# EAGLE design OnofreWireShield (EAGLE 9.3.2)
CNAME: BH ONOFRE; CREVISION: 5.1; DESIGNER: BrunoHorta
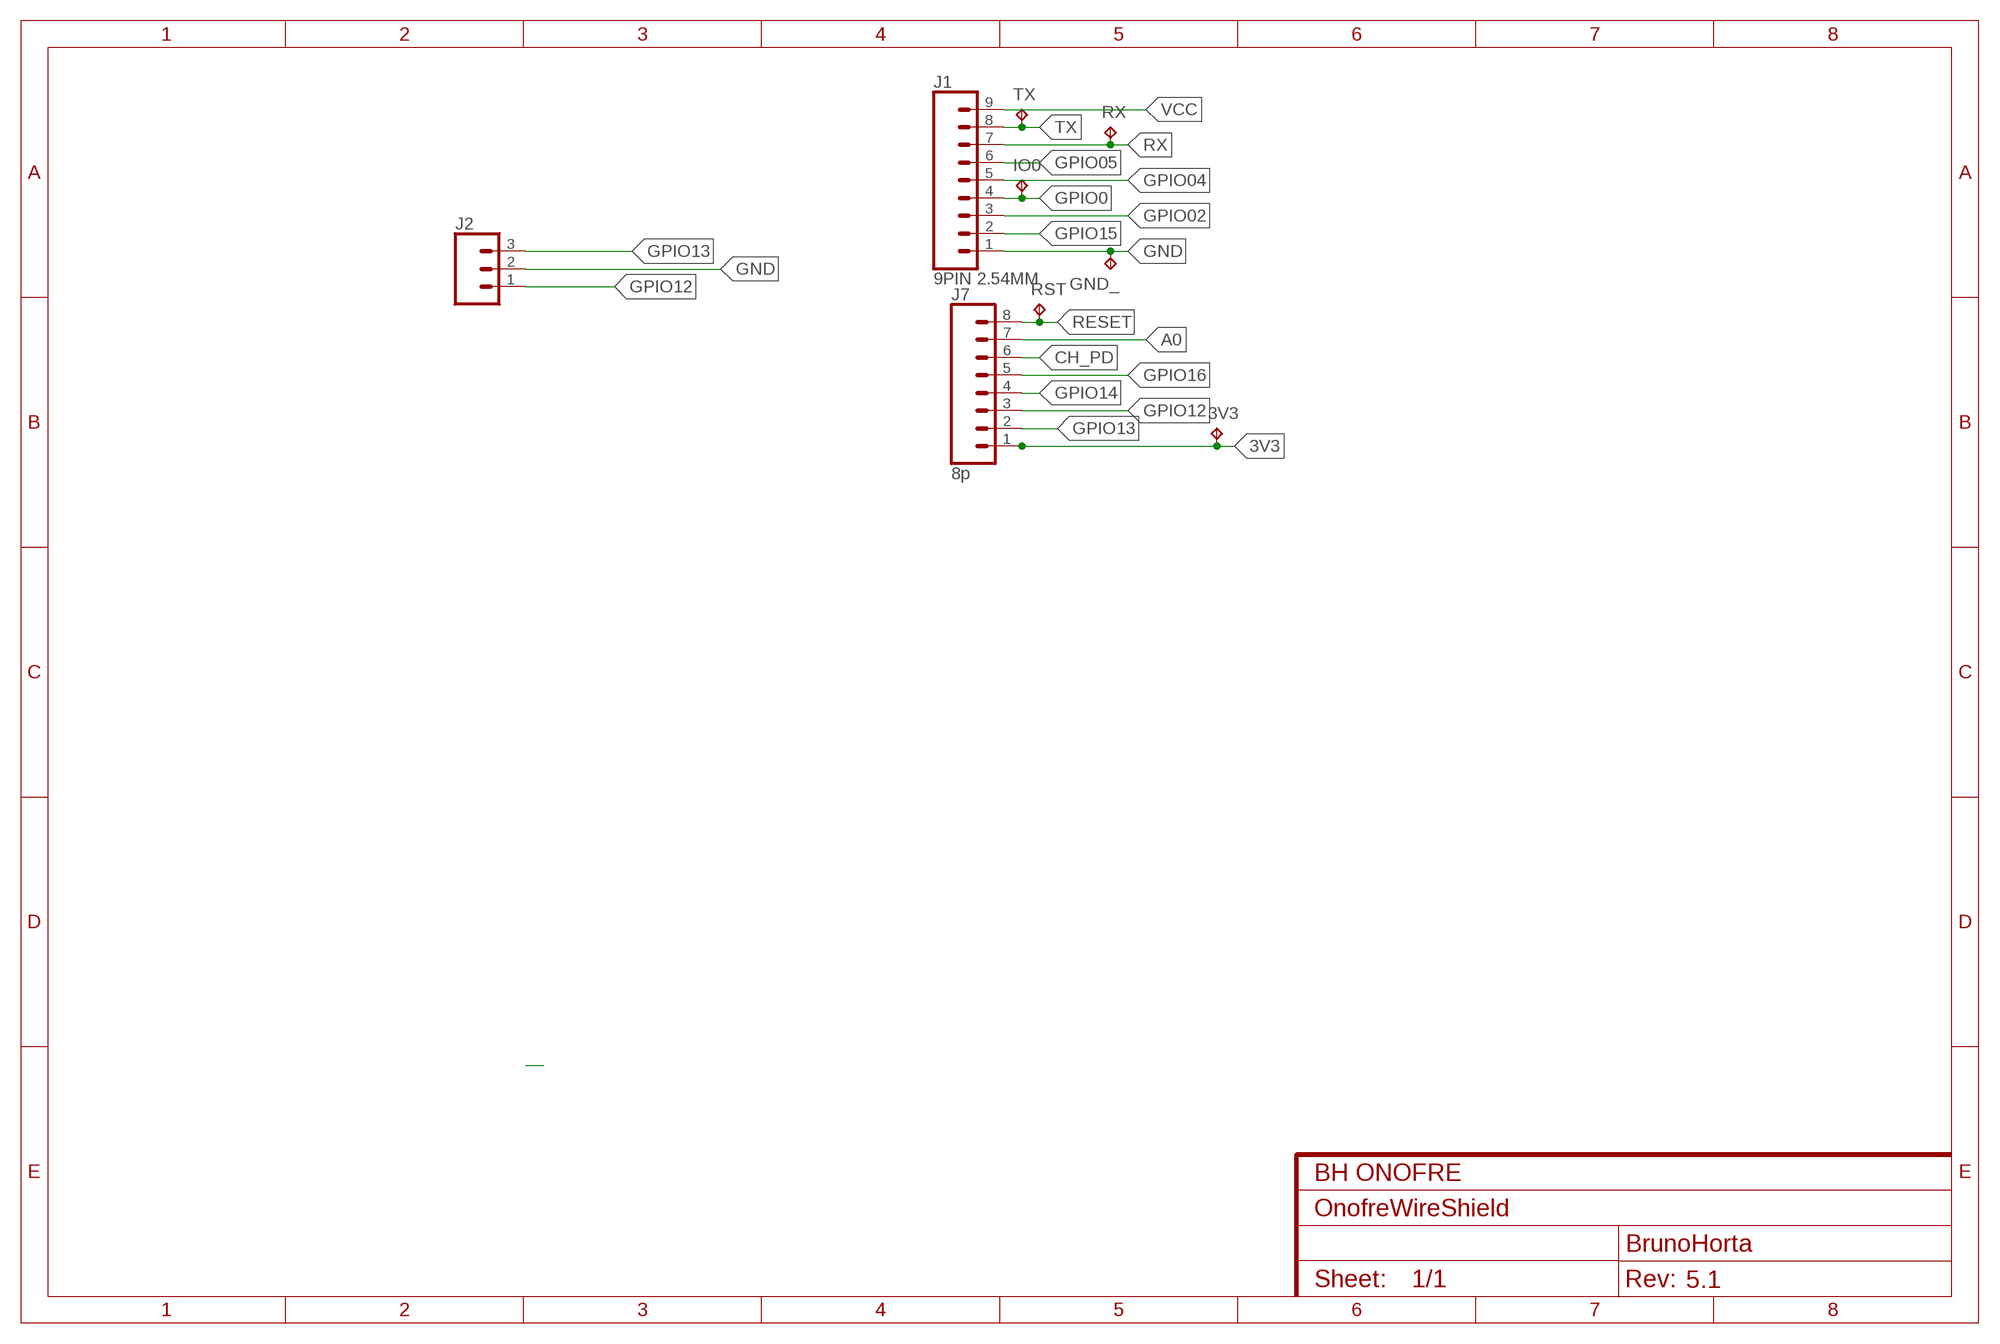
[diagram p0: schematic, sheet 1]

## Parts
3V3  TPB1,27  [B1,27]
GND_  TPB1,27  [B1,27]
IO0  TPB1,27  [B1,27]
J1  9PIN 2.54MM  CONN_09  [1X09]
J2  CONN_03  [1X03]
J7  8p  CONN_08"  [1X08]
RST  TPB1,27  [B1,27]
RX  TPB1,27  [B1,27]
TX  TPB1,27  [B1,27]

## Nets
3V3: 3V3.TP J7.1
A0: J7.7
CH_PD: J7.6
GND: GND_.TP J1.1 J2.2
GPIO0: IO0.TP J1.4
GPIO02: J1.3
GPIO04: J1.5
GPIO05: J1.6
GPIO12: J2.1 J7.3
GPIO13: J2.3 J7.2
GPIO14: J7.4
GPIO15: J1.2
GPIO16: J7.5
RESET: J7.8 RST.TP
RX: J1.7 RX.TP
TX: J1.8 TX.TP
VCC: J1.9

## Library data of the parts
3V3 GND_ IO0 RST RX TX = testpad:TP: Test pad
J1 = SparkFun-Connectors:CONN_09: Multi connection point. Often used as Generic Header-pin footprint for 0.1 inch spaced/style header connections On any of the 0.1 inch spaced packages, you can populate with these: Break Away Headers - Straight <https://www.sparkfun.com/products/116> (PRT-00116) Break Away Male Headers - Right Angle <https://www.sparkfun.com/products/553> (PRT-00553) Female Headers <https://www.sparkfun.com/products/115> (PRT-00115) Break Away Headers - Machine Pin <https://www.sparkfun.com/products/117> (PRT-00117) Break Away Female Headers - Swiss Machine Pin <https://www.sparkfun.com/products/743> (PRT-00743) For SCREWTERMINALS and SPRING TERMINALS visit here: Screw Terimnals on SparkFun.com <https://www.sparkfun.com/search/results?term=Screw+Terminals> (5mm/3.5mm/2.54mm spacing) This device is also useful as a general connection point to wire up your design to another part of your project. Our various solder wires solder well into these plated through hole pads. Hook-Up Wire - Assortment (Stranded, 22 AWG) <https://www.sparkfun.com/products/11375> (PRT-11375) Hook-Up Wire - Assortment (Solid Core, 22 AWG) <https://www.sparkfun.com/products/11367> (PRT-11367) View the entire wire category on our website here <https://www.sparkfun.com/categories/141> Special notes: Molex polarized connector foot print use with SKU : PRT-08231 with associated crimp pins and housings. 1MM SMD Version SKU: PRT-10208 NOTES ON THE VARIANTS LOCK and LOCK_LONGPADS... This footprint was designed to help hold the alignment of a through-hole component (i.e. 6-pin header) while soldering it into place. You may notice that each hole has been shifted either up or down by 0.005 of an inch from it's more standard position (which is a perfectly straight line). This slight alteration caused the pins (the squares in the middle) to touch the edges of the holes. Because they are alternating, it causes a "brace" to hold the component in place. 0.005 has proven to be the perfect amount of "off-center" position when using our standard breakaway headers. Although looks a little odd when you look at the bare footprint, once you have a header in there, the alteration is very hard to notice. Also,if you push a header all the way into place, it is covered up entirely on the bottom side.
J2 = SparkFun-Connectors:CONN_03: Multi connection point. Often used as Generic Header-pin footprint for 0.1 inch spaced/style header connections On any of the 0.1 inch spaced packages, you can populate with these: Break Away Headers - Straight <https://www.sparkfun.com/products/116> (PRT-00116) Break Away Male Headers - Right Angle <https://www.sparkfun.com/products/553> (PRT-00553) Female Headers <https://www.sparkfun.com/products/115> (PRT-00115) Break Away Headers - Machine Pin <https://www.sparkfun.com/products/117> (PRT-00117) Break Away Female Headers - Swiss Machine Pin <https://www.sparkfun.com/products/743> (PRT-00743) Stackable Header - 3 Pin (Female, 0.1") <https://www.sparkfun.com/products/13875> (PRT-13875) For SCREWTERMINALS and SPRING TERMINALS visit here: Screw Terimnals on SparkFun.com <https://www.sparkfun.com/search/results?term=Screw+Terminals> (5mm/3.5mm/2.54mm spacing) This device is also useful as a general connection point to wire up your design to another part of your project. Our various solder wires solder well into these plated through hole pads. Hook-Up Wire - Assortment (Stranded, 22 AWG) <https://www.sparkfun.com/products/11375> (PRT-11375) Hook-Up Wire - Assortment (Solid Core, 22 AWG) <https://www.sparkfun.com/products/11367> (PRT-11367) View the entire wire category on our website here <https://www.sparkfun.com/categories/141> Special notes: Molex polarized connector foot print use with SKU : PRT-08232 with associated crimp pins and housings.
J7 = SparkFun-Connectors:CONN_08: Multi connection point. Often used as Generic Header-pin footprint for 0.1 inch spaced/style header connections On any of the 0.1 inch spaced packages, you can populate with these: Break Away Headers - Straight <https://www.sparkfun.com/products/116> (PRT-00116) Break Away Male Headers - Right Angle <https://www.sparkfun.com/products/553> (PRT-00553) Female Headers <https://www.sparkfun.com/products/115> (PRT-00115) Break Away Headers - Machine Pin <https://www.sparkfun.com/products/117> (PRT-00117) Break Away Female Headers - Swiss Machine Pin <https://www.sparkfun.com/products/743> (PRT-00743) Arduino Stackable Header - 8 Pin <https://www.sparkfun.com/products/9279> (PRT-09279) For SCREWTERMINALS and SPRING TERMINALS visit here: Screw Terimnals on SparkFun.com <https://www.sparkfun.com/search/results?term=Screw+Terminals> (5mm/3.5mm/2.54mm spacing) This device is also useful as a general connection point to wire up your design to another part of your project. Our various solder wires solder well into these plated through hole pads. Hook-Up Wire - Assortment (Stranded, 22 AWG) <https://www.sparkfun.com/products/11375> (PRT-11375) Hook-Up Wire - Assortment (Solid Core, 22 AWG) <https://www.sparkfun.com/products/11367> (PRT-11367) View the entire wire category on our website here <https://www.sparkfun.com/categories/141> Special notes: Molex polarized connector foot print use with SKU : PRT-08231 with associated crimp pins and housings. 1MM SMD Version SKU: PRT-10208 NOTES ON THE VARIANTS LOCK and LOCK_LONGPADS... This footprint was designed to help hold the alignment of a through-hole component (i.e. 6-pin header) while soldering it into place. You may notice that each hole has been shifted either up or down by 0.005 of an inch from it's more standard position (which is a perfectly straight line). This slight alteration caused the pins (the squares in the middle) to touch the edges of the holes. Because they are alternating, it causes a "brace" to hold the component in place. 0.005 has proven to be the perfect amount of "off-center" position when using our standard breakaway headers. Although looks a little odd when you look at the bare footprint, once you have a header in there, the alteration is very hard to notice. Also,if you push a header all the way into place, it is covered up entirely on the bottom side.; PROD_ID: CONN-08438

## Net classes
1 220V: width 1.27 mm, clearance 2 mm

## Board
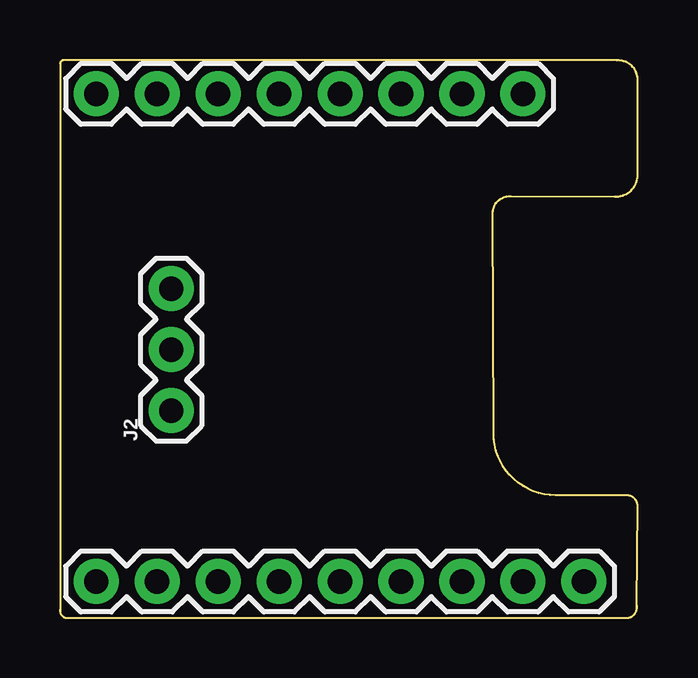
[diagram p1: board, top side]
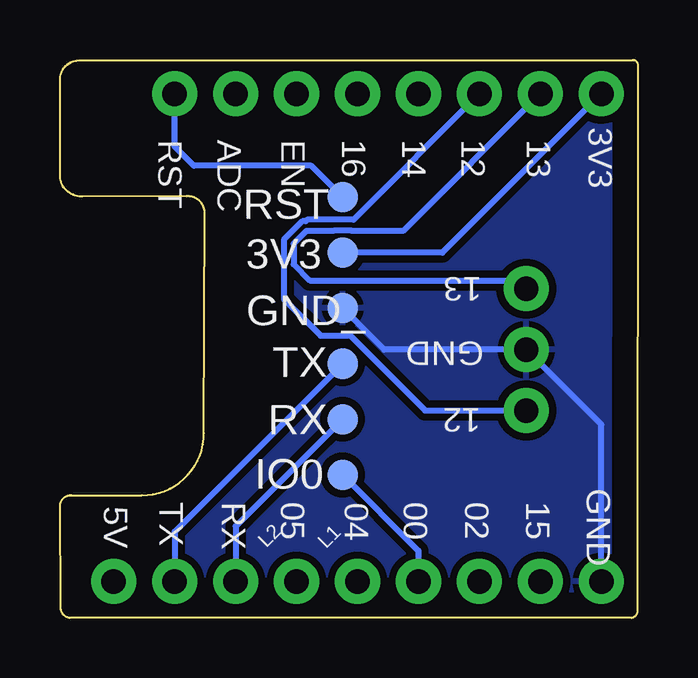
[diagram p2: board, bottom side, seen from below]

Size 24.06 x 23.27 mm. Coordinates in mm from the lower left corner, seen from the top.
Outline: 0,23.11 0.01,0.35 arc90 0.25,0 23.66,0 arc90 24.03,0.52 24.06,4.7 arc90 23.58,5.11 20.66,5.11 arc-90 18.07,7.7 18.04,16.96 arc-90 18.8,17.58 23.12,17.57 arc90 24.06,18.41 24.06,22.5 arc90 23.21,23.25 0.22,23.26 arc90 0,23.11
Copper layers (1*16): Top 0.035mm / dielectric 1.5mm / Bottom 0.035mm
Design rules "default": minimum track width 6mil, minimum drill 0.35mm, track to track 6mil, track to pad 6mil, pad to pad 6mil, via to via 6mil, smd to smd 6mil, copper to edge 40mil, drill to drill 6mil, minimum pad ring 10mil, minimum via ring 8mil, stop-mask expansion 4mil, vias tented up to drill 0mil, thermal gap 10mil

### Footprints (pad centres in the part's own frame; a part is rotated, then mirrored left to right if it is on the bottom)
B1,27 = smd 1.27 x 1.27: TP 0,0
1X09 = drill 1.016 pad 1.88: 1 0,0; 2 2.54,0; 3 5.08,0; 4 7.62,0; 5 10.16,0; 6 12.7,0; 7 15.24,0; 8 17.78,0; 9 20.32,0
1X03 = drill 1.016 pad 1.88: 1 0,0; 2 2.54,0; 3 5.08,0
1X08 = drill 1.016 pad 1.88: 1 0,0; 2 2.54,0; 3 5.08,0; 4 7.62,0; 5 10.16,0; 6 12.7,0; 7 15.24,0; 8 17.78,0

### Placement (x,y rotation side)
3V3  12.29,15.24 0 bottom
GND_  12.29,12.92 0 bottom
IO0  12.29,5.97 0 bottom
J1  1.51,1.52 0 top
J2  4.64,8.65 90 top
J7  1.51,21.86 0 top
RST  12.29,17.55 0 bottom
RX  12.29,8.28 0 bottom
TX  12.29,10.6 0 bottom

### Tracks (layer width: path | path; a pad name or v marks a point on that pad's centre or on a via)
3V3
  Bottom 0.254: J7.1 8.13,15.23 3V3.TP
GND
  Bottom 0.254: GND_.TP 10.56,11.19 J2.2 1.51,8.06 J1.1
  pour Bottom (isolate 0.305): 0.07,23.08 0.07,0.54 0.46,0.16 23.32,0.16 23.59,0.43 23.59,4.24 23.62,4.26 23,4.88 23,4.88 18.25,4.88 17.45,5.68 17.45,17.02 17.63,17.2 18.51,18.09 18.69,18.09 23,18.09 23.09,18.18 23.09,22.84 23.12,22.87 22.88,23.11 22.85,23.11 0.19,23.11 0.1,23.02
GPIO0
  Bottom 0.254: IO0.TP 9.13,2.81 J1.4
GPIO12
  Bottom 0.254: J7.3 11.84,16.61 13.77,16.61 13.83,16.54 13.97,16.54 14.73,15.78 14.73,13.3 13.21,11.77 11.97,11.77 8.85,8.65 J2.1
GPIO13
  Bottom 0.254: J7.2 9.77,16.14 11.9,16.14 11.91,16.15 12.67,16.15 12.68,16.14 13.8,16.14 14.33,15.61 14.33,14.75 13.65,14.07 4.98,14.07 J2.3
RESET
  Bottom 0.254: RST.TP 13.59,18.85 18.49,18.85 19.29,19.66 J7.8
RX
  Bottom 0.254: RX.TP 16.75,3.82 J1.7
TX
  Bottom 0.254: TX.TP 19.29,3.6 J1.8

### Text on the board
bNames: 3V3 | 13 | 12 | 14 | 16 | EN | ADC | RST | 13 | GND | 12 | GND | 15 | 02 | 00 | 04 | 05 | RX | TX | 5V | L1 | L2